# EAGLE design stm32f103-dev-board (EAGLE 8.2.2)
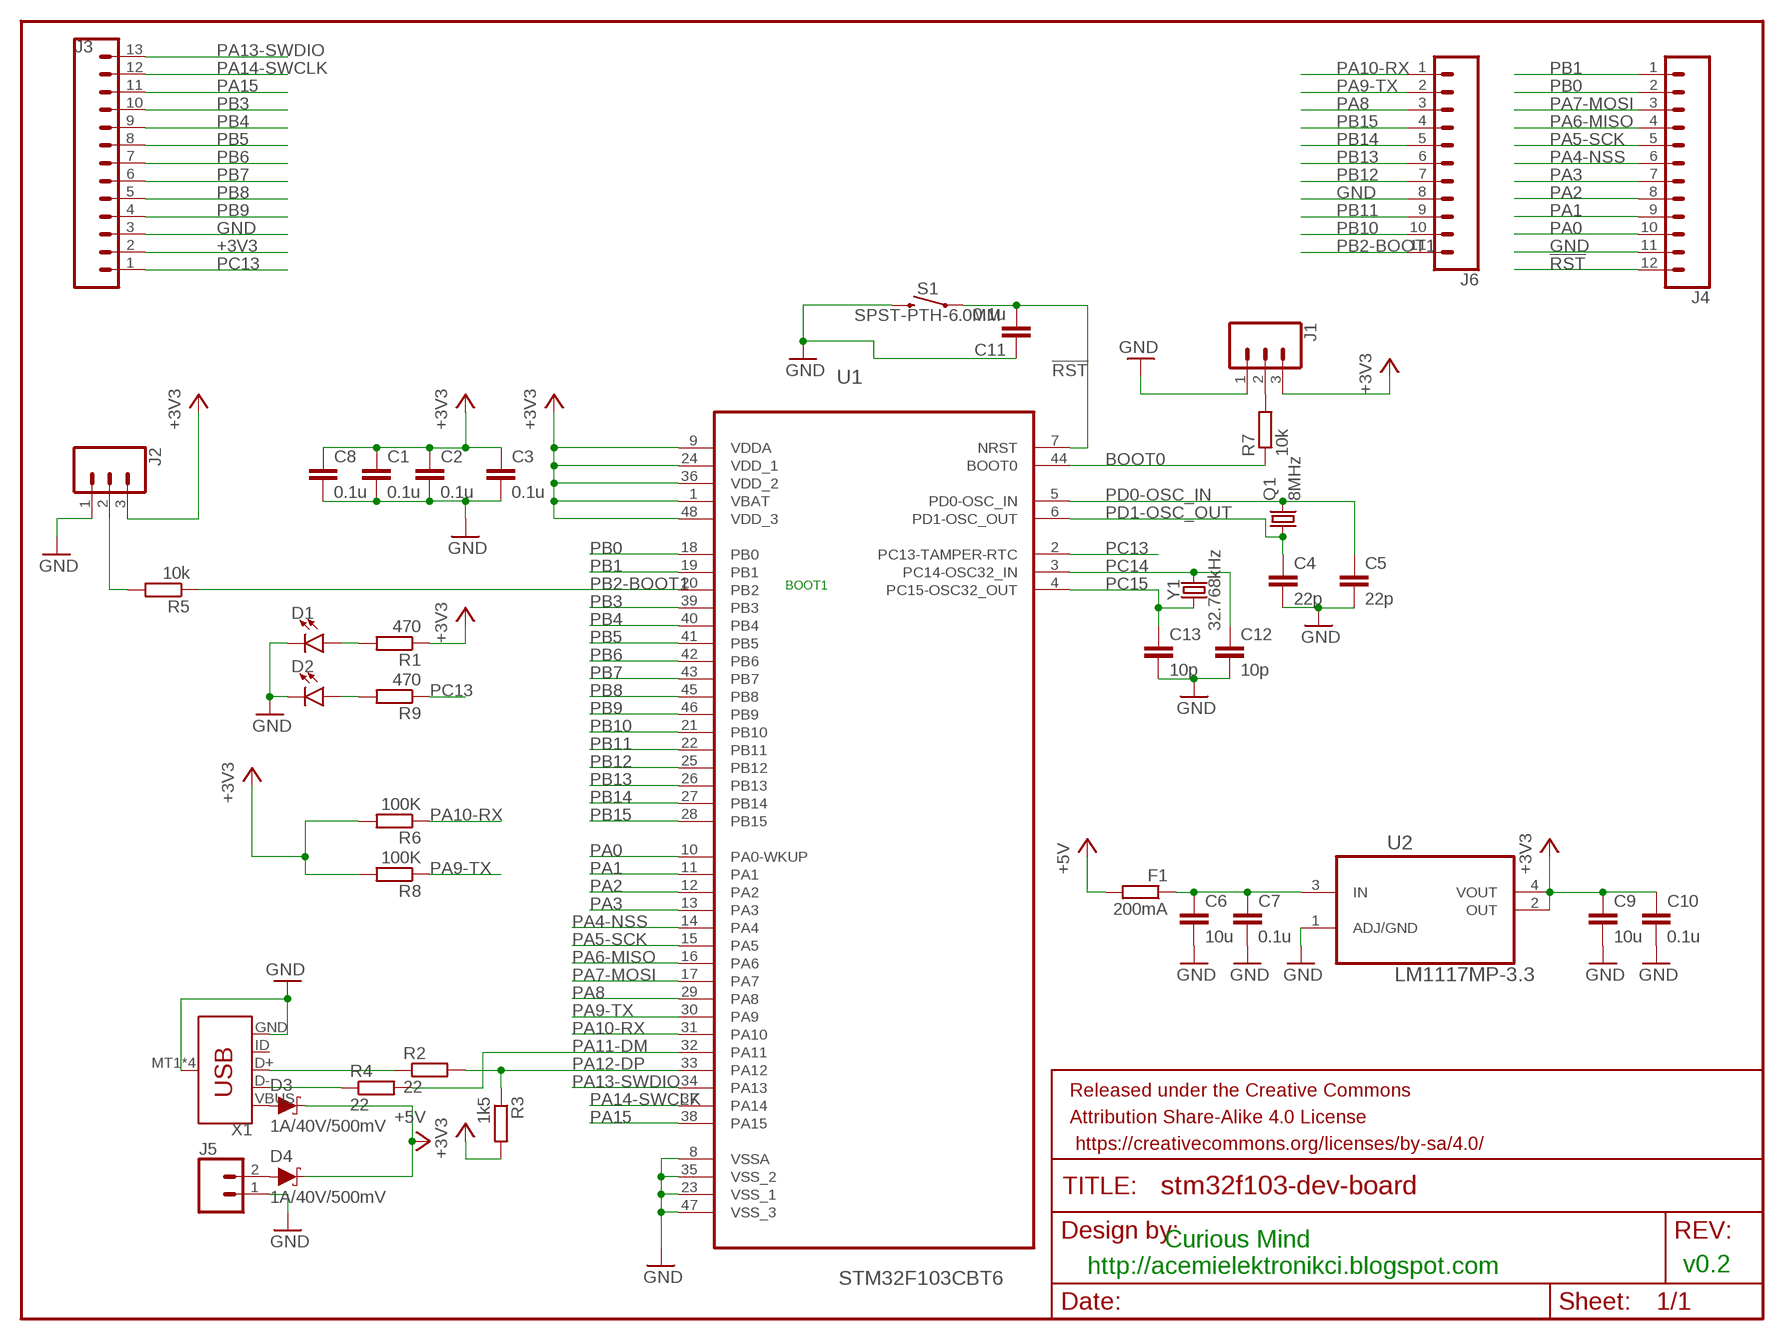
[diagram p0: schematic, sheet 1]

## Parts
C1  0.1u  C-EUC0805K  [C0805K]
C2  0.1u  C-EUC0805K  [C0805K]
C3  0.1u  C-EUC0805K  [C0805K]
C4  22p  C-EUC0805K  [C0805K]
C5  22p  C-EUC0805K  [C0805K]
C6  10u  C-EUC0805K  [C0805K]
C7  0.1u  C-EUC0805K  [C0805K]
C8  0.1u  C-EUC0805K  [C0805K]
C9  10u  C-EUC0805K  [C0805K]
C10  0.1u  C-EUC0805K  [C0805K]
C11  0.1u  C-EUC0805K  [C0805K]
C12  10p  C-EUC1206K  [C1206K]
C13  10p  C-EUC1206K  [C1206K]
D1  LED3MM  [LED_3MM]
D2  LED3MM  [LED_3MM]
D3  1A/40V/500mV  DIODE-SCHOTTKY-SS14  [SMA-DIODE]
D4  1A/40V/500mV  DIODE-SCHOTTKY-SS14  [SMA-DIODE]
F1  200mA  R-EU_R0805  [R0805]
FRAME1  FRAME-LETTER  [CREATIVE_COMMONS]
J1  CONN_03  [1X03]
J2  CONN_03  [1X03]
J3  CONN_13  [1X13]
J4  CONN_12  [1X12]
J5  CONN_02  [1X02]
J6  CONN_11  [1X11]
Q1  8MHz  CRYSTALHC49S  [HC49/S]
R1  470  R-EU_R0805  [R0805]
R2  22  R-EU_R0805  [R0805]
R3  1k5  R-EU_R1206  [R1206]
R4  22  R-EU_R0805  [R0805]
R5  10k  R-EU_R0805  [R0805]
R6  100K  R-EU_R0805  [R0805]
R7  10k  R-EU_R0805  [R0805]
R8  100K  R-EU_R0805  [R0805]
R9  470  R-EU_R0805  [R0805]
S1  SPST-PTH-6.0MM  MOMENTARY-SWITCH-SPST-PTH-6.0MM  [TACTILE_SWITCH_PTH_6.0MM]
U1  STM32F103CBT6  [QFP50P900X900X160-48N]
U2  LM1117MP-3.3  [SOT230P696X180-4N]
X1  USB_MICRO-B_SMT  [USB-MICROB]
Y1  32.768kHz  CRYSTAL-32.768KHZSMD-2X6  [CRYSTAL-SMD-2X6-CYL]

## Nets
!RST: C11.2 J4.12 S1.1 U1.7(NRST)
+3V3: C1.1 C2.1 C3.1 C8.1 C9.1 C10.1 J1.3 J2.3 J3.2 R1.1 R3.2 R6.2 R8.2 U1.1(VBAT) U1.9(VDDA) U1.24(VDD_1) U1.36(VDD_2) U1.48(VDD_3) U2.2(OUT) U2.4(VOUT)
+5V: D3.C D4.C F1.2
BOOT0: R7.1 U1.44(BOOT0)
GND: C1.2 C2.2 C3.2 C4.2 C5.2 C6.2 C7.2 C8.2 C9.2 C10.2 C11.1 C12.2 C13.2 D1.K(C) D2.K(C) J1.1 J2.1 J3.3 J4.11 J5.1 J6.8 S1.3 U1.8(VSSA) U1.23(VSS_1) U1.35(VSS_2) U1.47(VSS_3) U2.1(ADJ/GND) X1.GND X1.MT1(SHIELD) X1.MT2(SHIELD) X1.P$1(SHIELD) X1.P$2(SHIELD)
N$1: D3.A X1.VBUS
N$2: D2.A R9.2
N$3: D1.A R1.2
N$4: J1.2 R7.2
N$5: D4.A J5.2
N$7: C6.1 C7.1 F1.1 U2.3(IN)
N$16: R4.1 X1.D-
N$17: R2.1 X1.D+
N$22: J2.2 R5.2
PA0: J4.10 U1.10(PA0-WKUP)
PA1: J4.9 U1.11(PA1)
PA2: J4.8 U1.12(PA2)
PA3: J4.7 U1.13(PA3)
PA4-NSS: J4.6 U1.14(PA4)
PA5-SCK: J4.5 U1.15(PA5)
PA6-MISO: J4.4 U1.16(PA6)
PA7-MOSI: J4.3 U1.17(PA7)
PA8: J6.3 U1.29(PA8)
PA9-TX: J6.2 R8.1 U1.30(PA9)
PA10-RX: J6.1 R6.1 U1.31(PA10)
PA11-DM: R4.2 U1.32(PA11)
PA12-DP: R2.2 R3.1 U1.33(PA12)
PA13-SWDIO: J3.13 U1.34(PA13)
PA14-SWCLK: J3.12 U1.37(PA14)
PA15: J3.11 U1.38(PA15)
PB0: J4.2 U1.18(PB0)
PB1: J4.1 U1.19(PB1)
PB2-BOOT1: J6.11 R5.1 U1.20(PB2)
PB3: J3.10 U1.39(PB3)
PB4: J3.9 U1.40(PB4)
PB5: J3.8 U1.41(PB5)
PB6: J3.7 U1.42(PB6)
PB7: J3.6 U1.43(PB7)
PB8: J3.5 U1.45(PB8)
PB9: J3.4 U1.46(PB9)
PB10: J6.10 U1.21(PB10)
PB11: J6.9 U1.22(PB11)
PB12: J6.7 U1.25(PB12)
PB13: J6.6 U1.26(PB13)
PB14: J6.5 U1.27(PB14)
PB15: J6.4 U1.28(PB15)
PC13: J3.1 R9.1 U1.2(PC13-TAMPER-RTC)
PC14: C12.1 U1.3(PC14-OSC32_IN) Y1.X2
PC15: C13.1 U1.4(PC15-OSC32_OUT) Y1.X1
PD0-OSC_IN: C5.1 Q1.2 U1.5(PD0-OSC_IN)
PD1-OSC_OUT: C4.1 Q1.1 U1.6(PD1-OSC_OUT)
Unconnected: X1.ID

## Notes on the sheet
- BOOT1
- v0.2
- Curious Mind
  http://acemielektronikci.blogspot.com

## Library data of the parts
C1-C13 = rcl:C-EU: CAPACITOR, European symbol
D1 D2 = SparkFun-LED:LED: LED (Generic) Standard schematic elements and footprints for 5mm, 3mm, 1206, and 0603 sized LEDs. Generic LEDs with no color specified.; PROD_ID: DIO-08794
D3 D4 = SparkFun-DiscreteSemi:DIODE-SCHOTTKY: Schottky diode A Schottky diode is a semiconductor diode which has a low forward voltage drop and a very fast switching action.; PROD_ID: DIO-08053
F1 R1-R9 = rcl:R-EU_: RESISTOR, European symbol
FRAME1 = SparkFun-Aesthetics:FRAME-LETTER: Schematic Frame - Letter Standard 8.5x11 US Letter frame
J1 J2 = SparkFun-Connectors:CONN_03: Multi connection point. Often used as Generic Header-pin footprint for 0.1 inch spaced/style header connections On any of the 0.1 inch spaced packages, you can populate with these: Break Away Headers - Straight <https://www.sparkfun.com/products/116> (PRT-00116) Break Away Male Headers - Right Angle <https://www.sparkfun.com/products/553> (PRT-00553) Female Headers <https://www.sparkfun.com/products/115> (PRT-00115) Break Away Headers - Machine Pin <https://www.sparkfun.com/products/117> (PRT-00117) Break Away Female Headers - Swiss Machine Pin <https://www.sparkfun.com/products/743> (PRT-00743) Stackable Header - 3 Pin (Female, 0.1") <https://www.sparkfun.com/products/13875> (PRT-13875) For SCREWTERMINALS and SPRING TERMINALS visit here: Screw Terimnals on SparkFun.com <https://www.sparkfun.com/search/results?term=Screw+Terminals> (5mm/3.5mm/2.54mm spacing) This device is also useful as a general connection point to wire up your design to another part of your project. Our various solder wires solder well into these plated through hole pads. Hook-Up Wire - Assortment (Stranded, 22 AWG) <https://www.sparkfun.com/products/11375> (PRT-11375) Hook-Up Wire - Assortment (Solid Core, 22 AWG) <https://www.sparkfun.com/products/11367> (PRT-11367) View the entire wire category on our website here <https://www.sparkfun.com/categories/141> Special notes: Molex polarized connector foot print use with SKU : PRT-08232 with associated crimp pins and housings.
J3 = SparkFun-Connectors:CONN_13: Multi connection point. Often used as Generic Header-pin footprint for 0.1 inch spaced/style header connections On any of the 0.1 inch spaced packages, you can populate with these: Break Away Headers - Straight <https://www.sparkfun.com/products/116> (PRT-00116) Break Away Male Headers - Right Angle <https://www.sparkfun.com/products/553> (PRT-00553) Female Headers <https://www.sparkfun.com/products/115> (PRT-00115) Break Away Headers - Machine Pin <https://www.sparkfun.com/products/117> (PRT-00117) Break Away Female Headers - Swiss Machine Pin <https://www.sparkfun.com/products/743> (PRT-00743) For SCREWTERMINALS and SPRING TERMINALS visit here: Screw Terimnals on SparkFun.com <https://www.sparkfun.com/search/results?term=Screw+Terminals> (5mm/3.5mm/2.54mm spacing) This device is also useful as a general connection point to wire up your design to another part of your project. Our various solder wires solder well into these plated through hole pads. Hook-Up Wire - Assortment (Stranded, 22 AWG) <https://www.sparkfun.com/products/11375> (PRT-11375) Hook-Up Wire - Assortment (Solid Core, 22 AWG) <https://www.sparkfun.com/products/11367> (PRT-11367) View the entire wire category on our website here <https://www.sparkfun.com/categories/141> Special notes: Molex polarized connector foot print use with SKU : PRT-08231 with associated crimp pins and housings. 1MM SMD Version SKU: PRT-10208 NOTES ON THE VARIANTS LOCK and LOCK_LONGPADS... This footprint was designed to help hold the alignment of a through-hole component (i.e. 6-pin header) while soldering it into place. You may notice that each hole has been shifted either up or down by 0.005 of an inch from it's more standard position (which is a perfectly straight line). This slight alteration caused the pins (the squares in the middle) to touch the edges of the holes. Because they are alternating, it causes a "brace" to hold the component in place. 0.005 has proven to be the perfect amount of "off-center" position when using our standard breakaway headers. Although looks a little odd when you look at the bare footprint, once you have a header in there, the alteration is very hard to notice. Also,if you push a header all the way into place, it is covered up entirely on the bottom side.
J4 = SparkFun-Connectors:CONN_12: Multi connection point. Often used as Generic Header-pin footprint for 0.1 inch spaced/style header connections On any of the 0.1 inch spaced packages, you can populate with these: Break Away Headers - Straight <https://www.sparkfun.com/products/116> (PRT-00116) Break Away Male Headers - Right Angle <https://www.sparkfun.com/products/553> (PRT-00553) Female Headers <https://www.sparkfun.com/products/115> (PRT-00115) Break Away Headers - Machine Pin <https://www.sparkfun.com/products/117> (PRT-00117) Break Away Female Headers - Swiss Machine Pin <https://www.sparkfun.com/products/743> (PRT-00743) For SCREWTERMINALS and SPRING TERMINALS visit here: Screw Terimnals on SparkFun.com <https://www.sparkfun.com/search/results?term=Screw+Terminals> (5mm/3.5mm/2.54mm spacing) This device is also useful as a general connection point to wire up your design to another part of your project. Our various solder wires solder well into these plated through hole pads. Hook-Up Wire - Assortment (Stranded, 22 AWG) <https://www.sparkfun.com/products/11375> (PRT-11375) Hook-Up Wire - Assortment (Solid Core, 22 AWG) <https://www.sparkfun.com/products/11367> (PRT-11367) View the entire wire category on our website here <https://www.sparkfun.com/categories/141> Special notes: Molex polarized connector foot print use with SKU : PRT-08231 with associated crimp pins and housings. 1MM SMD Version SKU: PRT-10208 NOTES ON THE VARIANTS LOCK and LOCK_LONGPADS... This footprint was designed to help hold the alignment of a through-hole component (i.e. 6-pin header) while soldering it into place. You may notice that each hole has been shifted either up or down by 0.005 of an inch from it's more standard position (which is a perfectly straight line). This slight alteration caused the pins (the squares in the middle) to touch the edges of the holes. Because they are alternating, it causes a "brace" to hold the component in place. 0.005 has proven to be the perfect amount of "off-center" position when using our standard breakaway headers. Although looks a little odd when you look at the bare footprint, once you have a header in there, the alteration is very hard to notice. Also,if you push a header all the way into place, it is covered up entirely on the bottom side.
J5 = SparkFun-Connectors:CONN_02: Multi connection point. Often used as Generic Header-pin footprint for 0.1 inch spaced/style header connections On any of the 0.1 inch spaced packages, you can populate with these: Break Away Headers - Straight <https://www.sparkfun.com/products/116> (PRT-00116) Break Away Male Headers - Right Angle <https://www.sparkfun.com/products/553> (PRT-00553) Female Headers <https://www.sparkfun.com/products/115> (PRT-00115) Break Away Headers - Machine Pin <https://www.sparkfun.com/products/117> (PRT-00117) Break Away Female Headers - Swiss Machine Pin <https://www.sparkfun.com/products/743> (PRT-00743) For SCREWTERMINALS and SPRING TERMINALS visit here: Screw Terimnals on SparkFun.com <https://www.sparkfun.com/search/results?term=Screw+Terminals> (5mm/3.5mm/2.54mm spacing) This device is also useful as a general connection point to wire up your design to another part of your project. Our various solder wires solder well into these plated through hole pads. Hook-Up Wire - Assortment (Stranded, 22 AWG) <https://www.sparkfun.com/products/11375> (PRT-11375) Hook-Up Wire - Assortment (Solid Core, 22 AWG) <https://www.sparkfun.com/products/11367> (PRT-11367) View the entire wire category on our website here <https://www.sparkfun.com/categories/141> Special notes: Molex polarized connector foot print use with: PRT-08233 with associated crimp pins and housings. 2.54_SCREWTERM for use with PRT-10571. 3.5mm Screw Terminal footprints for PRT-08084 5mm Screw Terminal footprints for use with PRT-08432
J6 = SparkFun-Connectors:CONN_11: Multi connection point. Often used as Generic Header-pin footprint for 0.1 inch spaced/style header connections On any of the 0.1 inch spaced packages, you can populate with these: Break Away Headers - Straight <https://www.sparkfun.com/products/116> (PRT-00116) Break Away Male Headers - Right Angle <https://www.sparkfun.com/products/553> (PRT-00553) Female Headers <https://www.sparkfun.com/products/115> (PRT-00115) Break Away Headers - Machine Pin <https://www.sparkfun.com/products/117> (PRT-00117) Break Away Female Headers - Swiss Machine Pin <https://www.sparkfun.com/products/743> (PRT-00743) For SCREWTERMINALS and SPRING TERMINALS visit here: Screw Terimnals on SparkFun.com <https://www.sparkfun.com/search/results?term=Screw+Terminals> (5mm/3.5mm/2.54mm spacing) This device is also useful as a general connection point to wire up your design to another part of your project. Our various solder wires solder well into these plated through hole pads. Hook-Up Wire - Assortment (Stranded, 22 AWG) <https://www.sparkfun.com/products/11375> (PRT-11375) Hook-Up Wire - Assortment (Solid Core, 22 AWG) <https://www.sparkfun.com/products/11367> (PRT-11367) View the entire wire category on our website here <https://www.sparkfun.com/categories/141>
Q1 = crystal:CRYSTAL: CRYSTAL; OC_FARNELL: 1667008; OC_NEWARK: unknown
S1 = SparkFun-Switches:MOMENTARY-SWITCH-SPST: Momentary Switch (Pushbutton) - SPST Normally-open (NO) SPST momentary switches (buttons, pushbuttons). Variants PTH-12MM - 12mm square, through-hole Momentary Pushbutton Switch - 12mm Square <https://www.sparkfun.com/products/9190> (COM-09190) PTH-6.0MM, PTH-6.0MM-KIT - 6.0mm square, through-hole Mini Pushbutton Switch <https://www.sparkfun.com/products/97> (COM-00097) KIT package intended for soldering kit's - only one side of pads' copper is exposed. PTH-RIGHT-ANGLE-KIT - Right-angle, through-hole Right Angle Tactile Button <https://www.sparkfun.com/products/10791> - Used on SparkFun BigTime Watch Kit <https://www.sparkfun.com/products/11734> SMD-12MM - 12mm square, surface-mount Tactile Button - SMD (12mm) <https://www.sparkfun.com/products/12993> (COM-12993) Used on SparkFun PicoBoard <https://www.sparkfun.com/products/11888> SMD-4.5MM - 4.5mm Square Trackball Switch Used on SparkFun Blackberry Trackballer Breakout <https://www.sparkfun.com/products/13169> SMD-4.6MMX2.8MM - 4.60mm x 2.80mm, surface mount Used on SparkFun SAMD21 Mini Breakout <https://www.sparkfun.com/products/13664> SMD-5.2MM, SMD-5.2-REDUNDANT - 5.2mm square, surface-mount Mini Pushbutton Switch - SMD <https://www.sparkfun.com/products/8720> (COM-08720) Used on Arduino Pro Mini <https://www.sparkfun.com/products/11114> REDUNDANT package connects both switch circuits together SMD-6.0X3.5MM - 6.0 x 3.5mm, surface mount Momentary Reset Switch SMD <https://www.sparkfun.com/products/8229> (COM-08229) SMD-6.2MM-TALL - 6.2mm square, surface mount Tactile Button - SMD (6mm) <https://www.sparkfun.com/products/12992> Used on SparkFun Digital Sandbox <https://www.sparkfun.com/products/12651> SMD-RIGHT-ANGLE - Right-angle, surface mount Used on SparkFun Block for Intel® Edison - Arduino <https://www.sparkfun.com/products/13036>; PROD_ID: SWCH-08441; SF_SKU: COM-00097
U1 = ST Microelctronics_By_element14_Batch_1:STM32F103CBT6: Medium-density performance line ARM-based 32-bit MCU; MPN: STM32F103CBT6; OC_FARNELL: 1606327; OC_NEWARK: 11N8296; PACKAGE: QFP-48; SUPPLIER: STMICROELECTRONICS
U2 = NSC_By_element14_Batch_1.1:LM1117MP-3.3: Linear regulators; MPN: LM1117MP-3.3; OC_FARNELL: 9778195; OC_NEWARK: 41K3470; PACKAGE: SOT223-3; SUPPLIER: NationalSemiconductor
X1 = SparkFun-Connectors:USB_MICRO-B: USB Type Micro-B Connector Male/female and PTH/SMT variants SparkFun Products: SparkFun microB USB Breakout <https://www.sparkfun.com/products/12035> SparkFun USB microB Plug Breakout <https://www.sparkfun.com/products/10031> SparkFun ESP8266 Thing <https://www.sparkfun.com/products/13231>; PROD_ID: CONN-09505; SF_ID: PRT-08533
Y1 = SparkFun-Clocks:CRYSTAL-32.768KHZ: 32.768kHz Crystal Frequency: 32.768kHz Frequency Stability: ±20ppm Load Capacitance: 12.5pF (PTH-2X6 & SMD-3.2X1.5), 6pF (SMD-2X6) SparkFun Products: SparkFun BigTime Watch Kit <https://www.sparkfun.com/products/11734> SparkFun nRF52832 Breakout <https://www.sparkfun.com/products/13990> SparkFun Real Time Clock Module <https://www.sparkfun.com/products/12708>; PROD_ID: XTAL-07894

## Net classes
0 default: clearance 0.152 mm

## Board
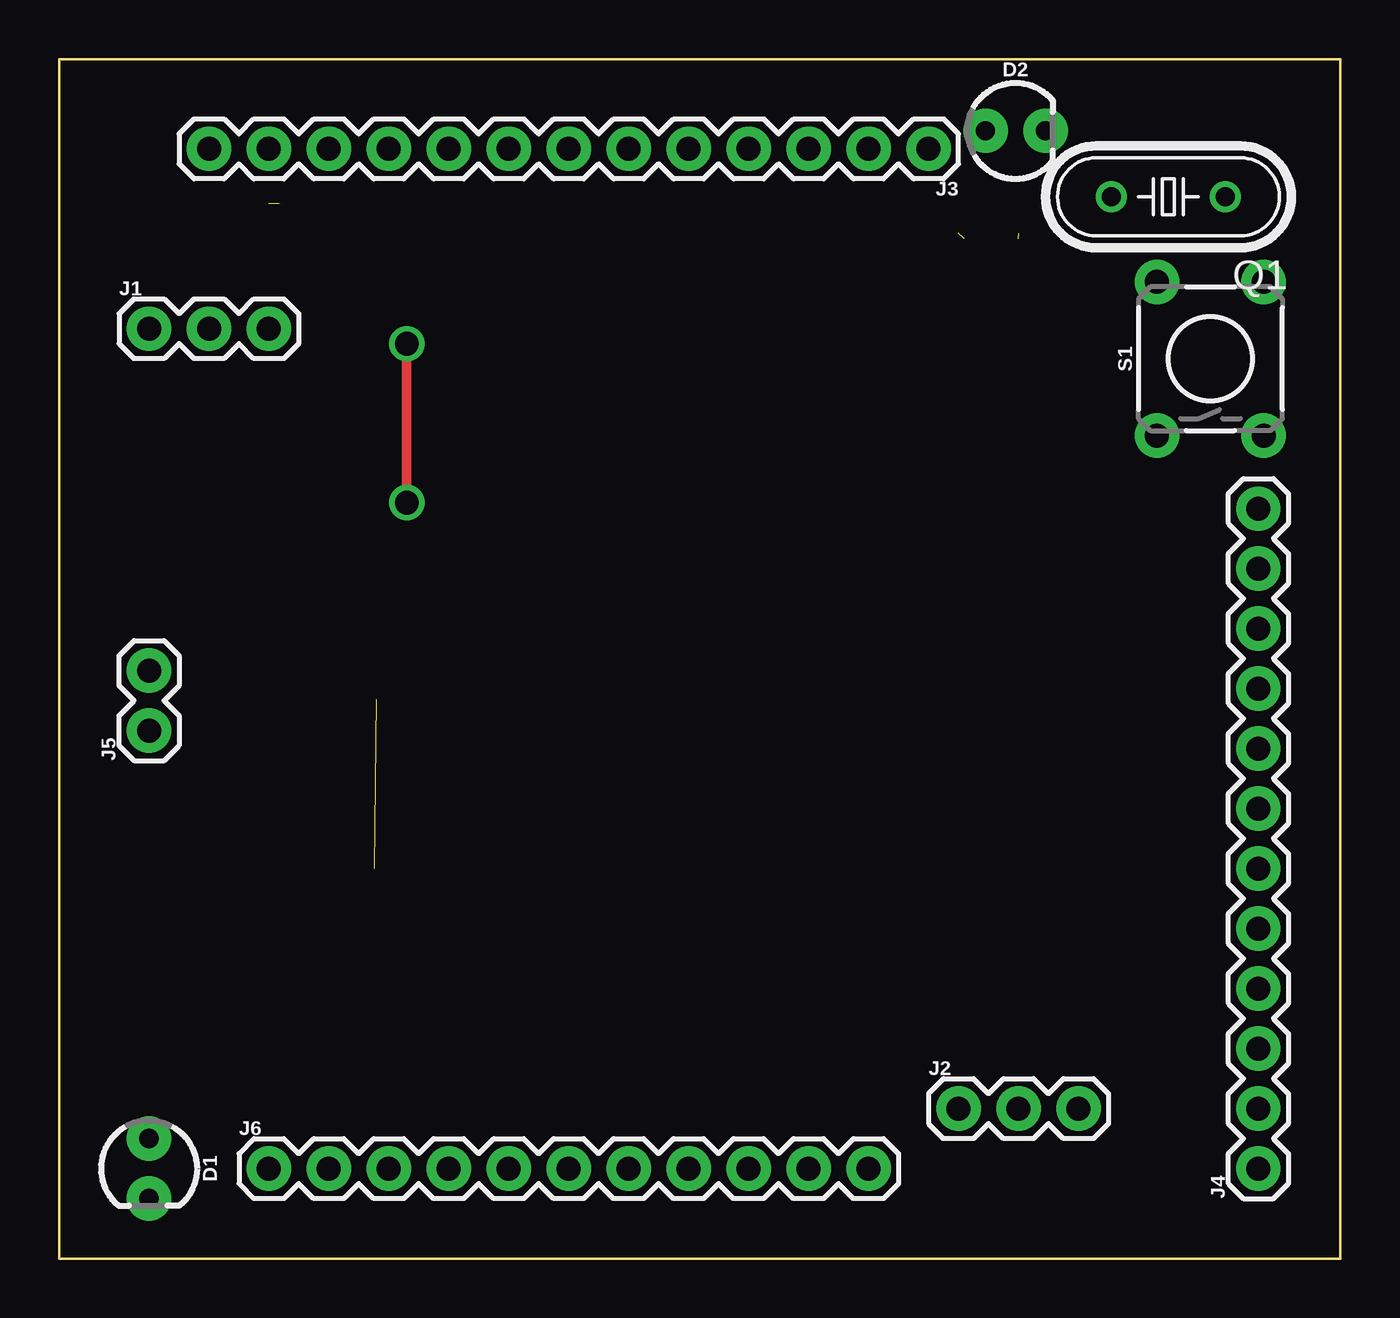
[diagram p1: board, top side]
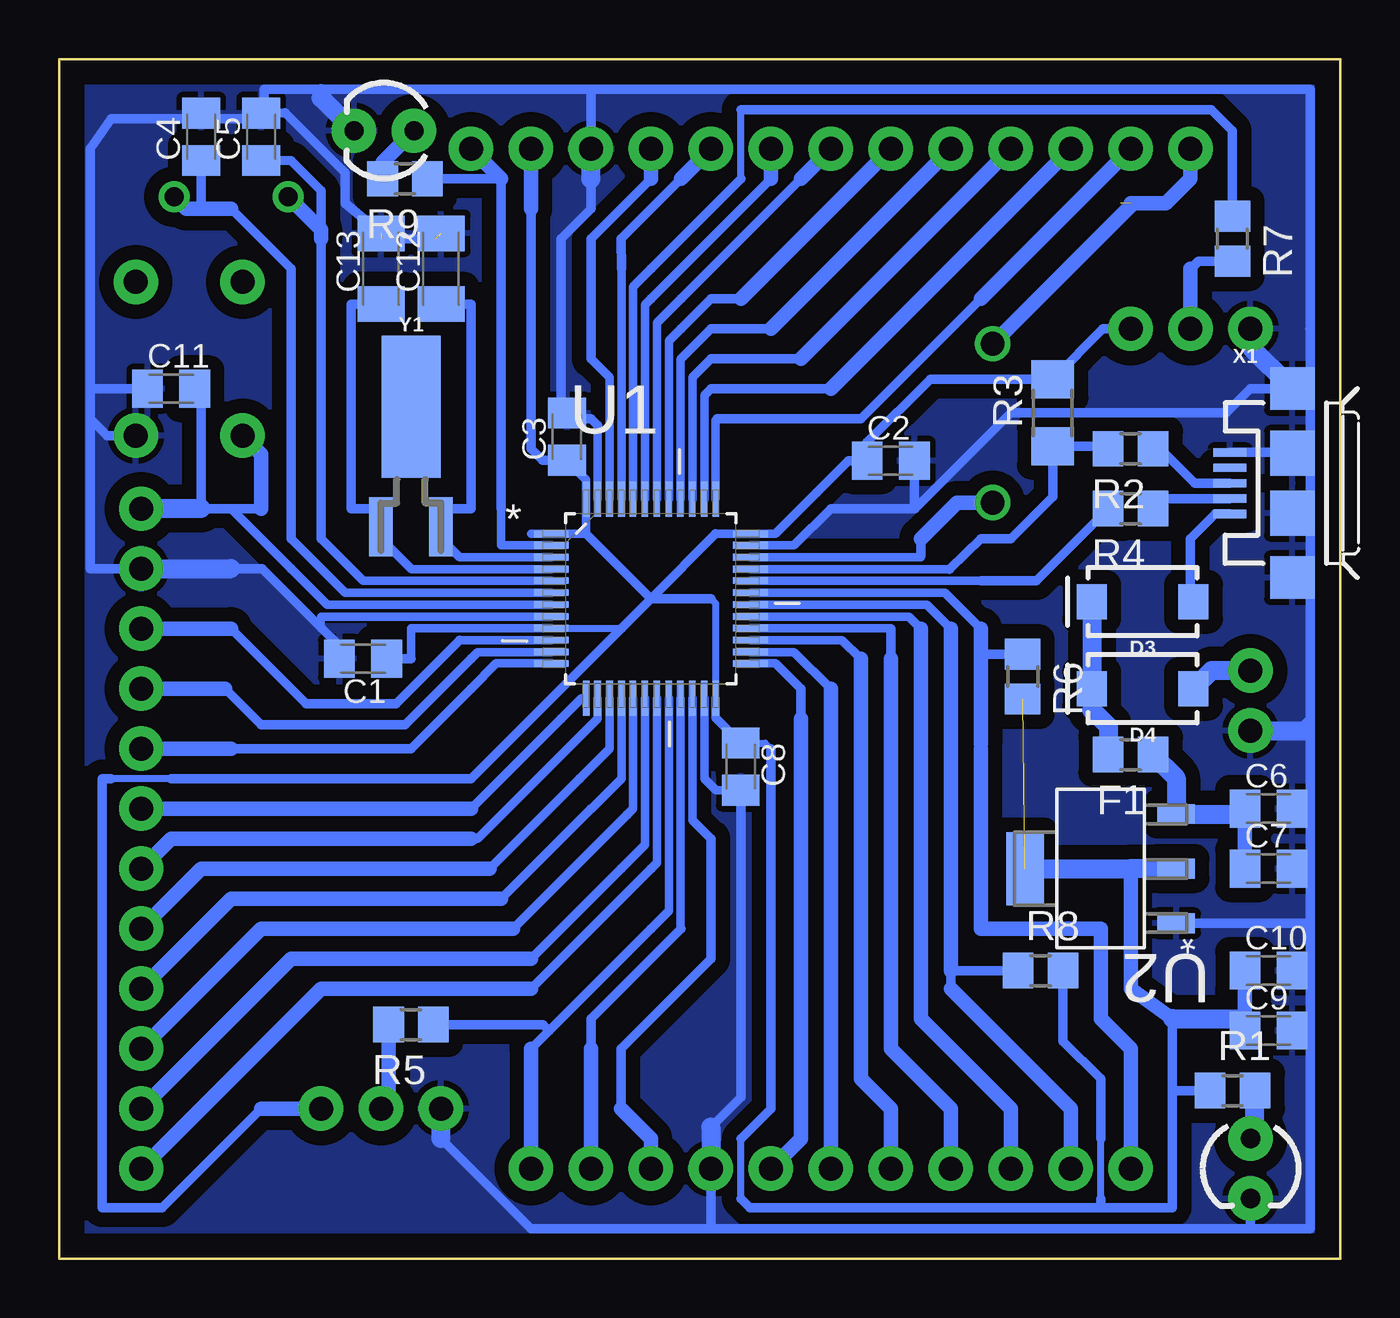
[diagram p2: board, bottom side, seen from below]

Size 54.28 x 50.79 mm. Coordinates in mm from the lower left corner, seen from the top.
Outline: 0,0 54.28,0 54.28,50.79 0,50.79 0,0
Copper layers (1*16): Top 0.035mm / dielectric 1.5mm / Bottom 0.035mm
Design rules "default": minimum track width 6mil, minimum drill 0.35mm, track to track 6mil, track to pad 6mil, pad to pad 6mil, via to via 6mil, smd to smd 6mil, copper to edge 40mil, drill to drill 6mil, minimum pad ring 10mil, minimum via ring 8mil, stop-mask expansion 4mil, vias tented up to drill 0mil, thermal gap 10mil

### Footprints (pad centres in the part's own frame; a part is rotated, then mirrored left to right if it is on the bottom)
C0805K = smd 1.3 x 1.6: 1 -1,0; 2 1,0
C1206K = smd 1.5 x 2: 1 -1.5,0; 2 1.5,0
LED_3MM = drill 0.813 pad 1.88: A -1.27,0; K 1.27,0
SMA-DIODE = smd 1.27 x 1.47: A -2.15,0; C 2.15,0
R0805 = smd 1.3 x 1.5: 1 -0.95,0; 2 0.95,0
1X03 = drill 1.016 pad 1.88: 1 0,0; 2 2.54,0; 3 5.08,0
1X13 = drill 1.016 pad 1.88: 1 0,0; 2 2.54,0; 3 5.08,0; 4 7.62,0; 5 10.16,0; 6 12.7,0; 7 15.24,0; 8 17.78,0; 9 20.32,0; 10 22.86,0; 11 25.4,0; 12 27.94,0; 13 30.48,0
1X12 = drill 1.016 pad 1.88: 1 0,0; 2 2.54,0; 3 5.08,0; 4 7.62,0; 5 10.16,0; 6 12.7,0; 7 15.24,0; 8 17.78,0; 9 20.32,0; 10 22.86,0; 11 25.4,0; 12 27.94,0
1X02 = drill 1.016 pad 1.88: 1 0,0; 2 2.54,0
1X11 = drill 1.016 pad 1.88: 1 0,0; 2 2.54,0; 3 5.08,0; 4 7.62,0; 5 10.16,0; 6 12.7,0; 7 15.24,0; 8 17.78,0; 9 20.32,0; 10 22.86,0; 11 25.4,0
HC49/S = drill 0.813: 1 -2.413,0; 2 2.413,0
R1206 = smd 1.6 x 1.803: 1 -1.422,0; 2 1.422,0
TACTILE_SWITCH_PTH_6.0MM = drill 1.016 pad 1.88: 1 -3.251,2.261; 2 3.251,2.261; 3 -3.251,-2.261; 4 3.251,-2.261
QFP50P900X900X160-48N = smd 1.473 x 0.279: 1 -4.216,2.743; 2 -4.216,2.261; 3 -4.216,1.753; 4 -4.216,1.245; 5 -4.216,0.762; 6 -4.216,0.254; 7 -4.216,-0.254; 8 -4.216,-0.762; 9 -4.216,-1.245; 10 -4.216,-1.753; 11 -4.216,-2.261; 12 -4.216,-2.743; 25 4.216,-2.743; 26 4.216,-2.261; 27 4.216,-1.753; 28 4.216,-1.245; 29 4.216,-0.762; 30 4.216,-0.254; 31 4.216,0.254; 32 4.216,0.762; 33 4.216,1.245; 34 4.216,1.753; 35 4.216,2.261; 36 4.216,2.743 | smd 0.279 x 1.473: 13 -2.743,-4.216; 14 -2.261,-4.216; 15 -1.753,-4.216; 16 -1.245,-4.216; 17 -0.762,-4.216; 18 -0.254,-4.216; 19 0.254,-4.216; 20 0.762,-4.216; 21 1.245,-4.216; 22 1.753,-4.216; 23 2.261,-4.216; 24 2.743,-4.216; 37 2.743,4.216; 38 2.261,4.216; 39 1.753,4.216; 40 1.245,4.216; 41 0.762,4.216; 42 0.254,4.216; 43 -0.254,4.216; 44 -0.762,4.216; 45 -1.245,4.216; 46 -1.753,4.216; 47 -2.261,4.216; 48 -2.743,4.216
SOT230P696X180-4N = smd 1.6 x 0.838: 1 -3.2,2.311; 2 -3.2,0; 3 -3.2,-2.311 | smd 1.6 x 3.099: 4 3.2,0
USB-MICROB = smd 1.4 x 0.35: D+ -2.65,0; D- -2.65,-0.65; GND -2.65,1.3; ID -2.65,0.65; VBUS -2.65,-1.3 | smd 1.9 x 1.8: MT1 0,-4; MT2 0,4 | smd 1.9 x 1.9: P$1 0,-1.27; P$2 0,1.27
CRYSTAL-SMD-2X6-CYL = smd 2.5 x 6: SHEILD 0,5.08 | smd 1 x 2.5: X1 -1.27,0; X2 1.27,0

### Placement (x,y rotation side)
C1  41.4,25.4 180 bottom
C2  19.05,33.78 0 bottom
C3  32.77,34.8 90 bottom
C4  48.26,47.5 90 bottom
C5  45.72,47.5 90 bottom
C6  3.05,19.05 0 bottom
C7  3.05,16.51 0 bottom
C8  25.4,20.83 270 bottom
C9  3.05,9.65 0 bottom
C10  3.05,12.19 0 bottom
C11  49.53,36.83 0 bottom
C12  38.1,41.91 90 bottom
C13  40.64,41.91 90 bottom
D1  3.81,3.81 270 top
D2  40.51,47.75 0 top
D3  8.38,27.81 180 bottom
D4  8.38,24.13 180 bottom
F1  8.89,21.34 180 bottom
FRAME1  -2.54,-7.62 0 top  (outside the outline)
J1  3.81,39.37 0 top
J2  38.1,6.35 0 top
J3  36.83,46.99 180 top
J4  50.8,3.81 90 top
J5  3.81,22.35 90 top
J6  8.89,3.81 0 top
Q1  46.99,44.96 180 top
R1  4.57,7.11 0 bottom
R2  8.89,34.29 180 bottom
R3  12.19,35.81 90 bottom
R4  8.89,31.75 180 bottom
R5  39.37,9.91 180 bottom
R6  13.46,24.64 270 bottom
R7  4.57,43.18 270 bottom
R8  12.7,12.19 0 bottom
R9  39.62,45.72 180 bottom
S1  48.77,38.1 90 top
U1  29.21,27.94 0 bottom
U2  10.16,16.51 180 bottom
X1  2.03,32.83 0 bottom
Y1  39.37,30.99 0 bottom

### Tracks (layer width: path | path; a pad name or v marks a point on that pad's centre or on a via)
!RST
  Bottom 0.356: U1.7 42.93,27.69 44.45,29.21
  Bottom 0.406: 46.99,31.75 44.45,29.21 | 45.72,31.75 46.99,31.75 | 46.99,31.75 48.26,31.75 48.26,36.56 C11.2
  Bottom 0.61: S1.1 45.72,34.06 45.72,31.75
  Bottom 0.813: 48.26,31.75 J4.12
+3V3  (1 unrouted)
  Bottom 0.305: 25.4,30.68 U1.36 | U1.9 30.45,26.7 | U1.24 26.47,27.74 26.67,27.94 | 49.53,20.32 52.07,20.32 | 24.13,21.59 24.37,21.83 C8.1 | 25.4,2.54 25.4,5.08 | 10.16,2.54 10.16,5.08
  Bottom 0.356: U1.9 39.37,26.7 39.37,25.4 | C3.1 31.95,32.98 U1.48 31.95,30.68 U1.1 34.29,30.68 | U1.24 26.47,22.89 C8.1 | 23.94,30.68 U1.36 26.47,30.68 | 23.94,30.68 23.93,30.68 | 23.94,30.68 22.19,32.43 22.11,32.51
  Bottom 0.406: 29.21,27.94 30.45,26.7 36.83,20.32 49.53,20.32 | 26.67,27.94 29.21,27.94 | 39.37,25.4 C1.1 | 52.07,20.32 52.45,20.32 52.45,2.16 49.91,2.16 45.72,6.35 | R8.2 11.75,9.21 10.16,7.62 10.16,5.08 | 10.16,2.16 7.11,2.16 7.11,7.11 | 10.16,2.16 25.02,2.16 25.4,2.54 | 24.13,21.59 24.13,6.35 25.4,5.08 | 10.16,2.16 10.16,2.54 | 7.11,7.11 7.11,10.16 | C3.1 33.8,33.8 34.29,34.29 34.29,44.45 | U2.4 13.46,16.51 | R1.1 7.11,7.11 | 31.95,30.68 29.21,27.94 | 26.47,30.68 29.21,27.94 | J1.3 10.06,39.37 R3.2 17.37,37.24 20.05,34.56 C2.1 20.84,33.78 22.19,32.43
  Bottom 0.61: 7.11,10.16 8.89,11.43 8.89,16.51 | J2.3 45.72,6.35 | C10.1 4.05,10.16 C9.1 | 34.29,44.45 J3.2
  Bottom 0.813: U2.4 8.89,16.51 U2.2 | 7.11,10.16 4.05,10.16
+5V
  Bottom 0.813: D3.C D4.C 10.53,23.23 9.84,22.54 F1.2
BOOT0
  Bottom 0.305: 25.4,45.72 25.4,48.64
  Bottom 0.356: U1.44 29.97,41.15 29.21,41.91
  Bottom 0.406: 29.21,41.91 25.4,45.72 | 25.4,48.64 5.46,48.64 4.57,47.75 R7.1
GND  (2 unrouted)
  Bottom 0.254: 1.27,34.13 X1.P$2
  Bottom 0.305: 43.18,27.18 43.18,26.72 43.15,26.7
  Bottom 0.356: 31.47,35.28 U1.47 | U1.8 43.18,27.18 | U1.23 26.95,20.32 26.46,19.83 C8.2 | U1.35 23.14,30.2 21.59,31.75
  Bottom 0.406: X1.GND 1.27,34.13 | 33.01,35.35 C3.2 | 31.47,35.28 31.75,35.56 32.8,35.56 33.01,35.35 | J3.3 31.75,49.51 | 33.01,35.35 33.01,43.17 33.02,43.18 31.75,44.45 31.75,45.72 | 52.96,35.56 52.96,29.21 J4.11 | 52.96,35.56 52.96,36.83 | 52.96,36.83 52.96,46.99 52.07,48.26 48.53,48.26 C4.2 48.02,48.26 45.72,48.26 C5.2 | C1.2 42.4,25.94 43.15,26.7 45.67,29.21 46.99,29.21 | 1.27,39.33 1.27,36.83 | 1.27,39.33 1.27,49.51 31.75,49.51 | J6.8 26.67,1.27 | 3.81,1.27 1.27,1.27 1.27,10.16 | 3.81,1.27 26.67,1.27 | 26.67,1.27 34.29,1.27 38.1,5.08 | S1.3 52.25,34.85 52.96,35.56 | C11.1 52.96,36.83 | 26.67,5.56 25.4,6.83 C8.2 | 40.62,43.18 38.35,43.18 | C5.2 45.6,48.38 45.6,49.51 43.18,49.51 | 31.75,49.51 43.18,49.51 | 1.27,36.83 1.27,34.29 | 1.27,34.29 1.27,31.75 | 1.27,31.75 1.27,29.21 | 1.27,29.21 1.27,22.86 | 1.27,22.86 1.27,19.05 | 1.27,19.05 1.27,16.51 | 1.27,16.51 1.27,13.97 | 1.27,13.97 1.27,12.7 | 1.27,12.7 1.27,10.16 | C9.2 1.27,10.16 | C10.2 1.27,12.7 | C7.2 1.27,16.51 | C6.2 1.27,19.05 | X1.MT1 1.65,29.21 1.27,29.21 | X1.P$1 1.84,31.75 1.27,31.75 | X1.P$2 1.84,34.29 1.27,34.29 | 1.27,36.83 X1.MT2 2.14,36.93 | U2.1 1.5,14.2 1.27,13.97 | D1.K 3.81,1.27 | C13.2 42.16,44.68 42.16,45.97 44.7,48.51 C5.2 | 1.47,22.35 1.47,22.66 1.27,22.86 | 43.18,49.42 43.18,49.51 | 2.14,36.93 2.29,37.08 | 1.31,39.37 1.27,39.33 | 2.14,36.93 2.24,36.83 3.81,36.83 4.83,35.81 13.97,35.81 18.03,31.75 18.18,31.75 | 18.18,31.75 21.59,31.75 | C2.2 18.05,31.88 18.18,31.75
  Bottom 0.61: 43.18,49.15 43.18,49.42
  Bottom 0.813: 38.1,5.08 J2.1 | 26.67,5.56 J6.8 | J4.11 46.99,29.21 | 31.75,45.72 J3.3 | J5.1 1.47,22.35 | D2.K 43.18,49.15 | J1.1 3.81,38.61 2.14,36.93
  pour Bottom (isolate 0.61): 0,50.8 54.61,50.8 54.61,0 0,0
N$1
  Bottom 0.406: X1.VBUS 5.3,31.53 6.35,30.48 6.35,27.93 D3.A
N$2
  Bottom 0.61: D2.A 40.57,46.42 R9.2
N$3
  Bottom 0.813: D1.A 3.62,5.08 R1.2
N$4
  Bottom 0.406: R7.2 6.03,42.23 6.35,41.91
  Bottom 0.61: 6.35,41.91 J1.2
N$5
  Bottom 0.813: J5.2 5.47,24.89 D4.A
N$7
  Bottom 0.406: C6.1 4.28,18.82 4.05,18.59
  Bottom 0.61: C7.1 4.05,18.59
  Bottom 0.813: F1.1 6.96,20.36 U2.3 4.28,18.82
N$16
  Bottom 0.406: R4.1 7.62,31.75 7.62,32.18 X1.D-
N$17
  Bottom 0.406: X1.D+ 6.16,32.83 7.62,34.29 R2.1
N$22
  Bottom 0.61: R5.2 40.32,6.67 J2.2
PA0
  Bottom 0.356: 37.31,26.19 U1.10
  Bottom 0.406: 37.31,26.19 40.01,23.5 43.81,23.5 46.99,26.67
  Bottom 0.61: J4.10 46.99,26.67
PA1
  Bottom 0.356: U1.11 36.55,25.68 36.83,25.4
  Bottom 0.406: 36.83,25.4 39.62,22.61 45.72,22.61 47.24,24.13
  Bottom 0.61: 47.24,24.13 J4.9
PA2
  Bottom 0.356: U1.12 35.76,25.2 36.83,24.13
  Bottom 0.406: 36.83,24.13 39.37,21.59 46.99,21.59
  Bottom 0.61: 46.99,21.59 J4.8
PA3
  Bottom 0.305: U1.13 32.16,23.72
  Bottom 0.356: 32.16,23.72 33.02,22.86
  Bottom 0.406: 33.02,22.86 36.83,19.05
  Bottom 0.61: J4.7 36.83,19.05
PA4-NSS
  Bottom 0.305: 36.55,17.78 36.83,17.78
  Bottom 0.356: 36.55,17.78 31.47,22.86 U1.14
  Bottom 0.61: J4.6 49.53,17.78 36.83,17.78
PA5-SCK
  Bottom 0.356: U1.15 30.96,21.59 32.23,20.32
  Bottom 0.406: 36.04,16.51 32.23,20.32
  Bottom 0.61: J4.5 48.26,16.51 36.04,16.51
PA6-MISO
  Bottom 0.305: 31.73,19.05 31.75,19.05
  Bottom 0.356: 31.73,19.05 30.45,20.32 U1.16
  Bottom 0.406: 31.75,19.05 35.56,15.24
  Bottom 0.61: J4.4 46.99,15.24 35.56,15.24
PA7-MOSI
  Bottom 0.356: 30.23,18.8 29.97,19.05 U1.17
  Bottom 0.406: 30.23,18.8 35.05,13.97
  Bottom 0.61: J4.3 45.72,13.97 35.05,13.97
PA8
  Bottom 0.356: U1.29 18.29,27.18 17.78,26.67
  Bottom 0.61: 17.78,26.67 17.78,10.16 13.97,6.35 J6.3
PA9-TX
  Bottom 0.356: 16.51,26.67 17.53,27.69 U1.30
  Bottom 0.406: 16.51,11.43 16.51,12.19 R8.1
  Bottom 0.61: 16.51,26.67 16.51,12.19 | 16.51,11.43 11.43,6.35 J6.2
PA10-RX
  Bottom 0.356: 15.24,26.67 16.76,28.19 U1.31
  Bottom 0.406: 15.24,21.78 15.24,21.59 | R6.1 15.16,25.59 15.24,25.51
  Bottom 0.61: 15.24,21.59 15.24,13.97 10.16,13.97 10.16,10.16 8.89,8.89 J6.1 | 15.24,21.78 15.24,25.51 15.24,26.67
PA11-DM
  Bottom 0.356: U1.32 15.24,28.7 15.1,28.7
  Bottom 0.406: 15.24,28.7 12.89,28.7 R4.2
PA12-DP
  Bottom 0.356: 16.54,29.21 15.24,30.48 | U1.33 16.56,29.18
  Bottom 0.406: 10.16,34.29 R2.2 9.94,34.39 R3.1 12.19,32.26 13.97,30.48 15.24,30.48 | 16.56,29.18 16.54,29.21
PA13-SWDIO  (via drill 1)  (1 unrouted)
  Top 0.406: v14.73,32 v14.73,38.73
  Bottom 0.356: U1.34 17.78,29.69 17.78,29.77
  Bottom 0.406: 17.78,30.48 17.78,29.77 17.83,29.72 | 8.89,44.68 8.89,44.58
  Bottom 0.61: J3.13 6.35,45.72 7.39,44.68 8.89,44.68 | v14.73,32 16.26,32 17.78,30.48 | 8.89,44.58 v14.73,38.73
PA14-SWCLK
  Bottom 0.305: 26.42,35.56 26.47,35.56
  Bottom 0.356: U1.37 26.47,35.49 26.39,35.56
  Bottom 0.406: 26.42,35.56 26.39,35.56 20.32,35.56 15.24,40.64
  Bottom 0.61: J3.12 15.24,40.64
PA15
  Bottom 0.356: U1.38 26.95,36.55 26.67,36.83
  Bottom 0.406: 21.59,36.83 26.67,36.83
  Bottom 0.61: J3.11 21.59,36.83
PB0
  Bottom 0.356: 30.48,16.51 29.46,17.53 U1.18
  Bottom 0.406: 30.48,16.51 34.29,12.7
  Bottom 0.61: J4.2 44.45,12.7 34.29,12.7
PB1
  Bottom 0.356: 29.21,16.51 28.96,16.76 U1.19
  Bottom 0.406: 34.29,11.43 29.21,16.51
  Bottom 0.61: J4.1 43.18,11.43 34.29,11.43
PB2-BOOT1
  Bottom 0.356: 29.21,13.97 28.45,14.73 U1.20
  Bottom 0.406: R5.1 33.78,9.91 33.53,9.65 | 33.53,9.65 34.29,8.89 | 29.21,13.97 33.53,9.65
  Bottom 0.61: 34.29,8.89 J6.11
PB3
  Bottom 0.356: U1.39 27.46,37.31 26.67,38.1
  Bottom 0.406: 22.86,38.1 26.67,38.1
  Bottom 0.61: J3.10 22.86,38.1
PB4
  Bottom 0.356: U1.40 27.96,38.08 26.67,39.37
  Bottom 0.406: 24.13,39.37 26.67,39.37
  Bottom 0.61: J3.9 17.78,45.72 24.13,39.37
PB5
  Bottom 0.356: U1.41 28.45,38.86 27.94,39.37
  Bottom 0.406: 25.4,40.64 26.67,40.64 27.94,39.37
  Bottom 0.61: J3.8 20.32,45.72 25.4,40.64
PB6
  Bottom 0.356: U1.42 28.96,39.62 27.94,40.64
  Bottom 0.406: 22.86,45.72 27.94,40.64
  Bottom 0.61: J3.7 22.86,45.72
PB7
  Bottom 0.356: U1.43 29.46,40.39 29.21,40.64
  Bottom 0.406: 24.13,45.72 29.21,40.64
  Bottom 0.61: J3.6 24.13,45.72
PB8
  Bottom 0.356: U1.45 30.45,41.91
  Bottom 0.406: 30.45,41.91 30.48,43.18 27.94,45.72
  Bottom 0.61: J3.5 27.94,45.72
PB9
  Bottom 0.356: U1.46 30.96,37.31 31.75,38.1
  Bottom 0.406: 31.75,38.1 31.75,43.18 29.21,45.72
  Bottom 0.61: J3.4 29.21,45.72
PB10
  Bottom 0.305: 27.96,13.99 27.94,13.97
  Bottom 0.356: U1.21 27.96,13.99
  Bottom 0.406: 27.94,13.97 31.75,10.16 31.75,8.89
  Bottom 0.61: J6.10 31.75,8.89
PB11
  Bottom 0.356: U1.22 27.46,18.57 26.67,17.78
  Bottom 0.406: 26.67,17.78 26.67,12.7 30.48,8.89 30.48,6.35
  Bottom 0.61: J6.9 29.21,5.08 30.48,6.35
PB12
  Bottom 0.356: U1.25 23.93,25.2 22.86,24.13
  Bottom 0.406: 22.86,24.13 22.86,22.86
  Bottom 0.61: J6.7 22.86,5.08 22.86,22.86
PB13
  Bottom 0.356: U1.26 23.14,25.68 21.59,24.13
  Bottom 0.61: 21.59,24.13 J6.6
PB14
  Bottom 0.356: U1.27 21.11,26.19 20.32,25.4
  Bottom 0.61: 20.32,25.4 20.32,7.62 19.05,6.35 J6.5
PB15
  Bottom 0.305: 19.07,26.7 19.05,26.67
  Bottom 0.356: U1.28 19.07,26.7
  Bottom 0.406: 19.05,26.67 19.05,25.4
  Bottom 0.61: J6.4 16.51,6.35 19.05,8.89 19.05,25.4
PC13
  Bottom 0.356: U1.2 35.56,30.2 35.56,31.75
  Bottom 0.406: 35.56,31.75 35.56,45.72 R9.1
  Bottom 0.61: J3.1 35.56,45.72
PC14
  Bottom 0.356: U1.3 37.31,29.69 38.1,30.48
  Bottom 0.406: 38.1,30.48 Y1.X2 38.1,31.75 36.83,31.75 36.83,40.41 C12.1
PC15
  Bottom 0.356: 40.64,30.48 39.34,29.18 U1.4
  Bottom 0.406: 40.64,30.48 Y1.X1 40.64,31.75 41.91,31.75 41.91,40.41 C13.1
PD0-OSC_IN
  Bottom 0.356: U1.5 41.4,28.7 43.18,30.48
  Bottom 0.406: 43.18,30.48 43.18,43.18 43.18,45.21 44.45,46.48 C5.1
  Bottom 0.61: Q1.2 43.18,43.56 43.18,43.18
PD1-OSC_OUT
  Bottom 0.356: 44.45,30.48 42.16,28.19 U1.6
  Bottom 0.406: 46.99,44.45 44.45,41.91 44.45,30.48 | C4.1 48.26,44.45
  Bottom 0.61: Q1.1 48.9,44.45 48.26,44.45 46.99,44.45

### Text on the board
tDocu: LED | A13 / A14 / A15 / B3 / B4 / B5 / B6 / B7 / B8 / B9 / GND / 3V3 / C13 | -BOOT0+ | RESET | STM32F103C8T6 / DEV BOARD | - + / / PWR / IN | PWR | A10-RX / A9-TX / A8 / B15 / B14 / B13 / B12 / GND / B11 / B10 / B2-BOOT1 | -BOOT1+ | RST / GND / A0 / A1 / A2 / A3 / A4 / SCK-A5 / MISO-A6 / MOSI-A7 / B0 / B1 | Curious Mind